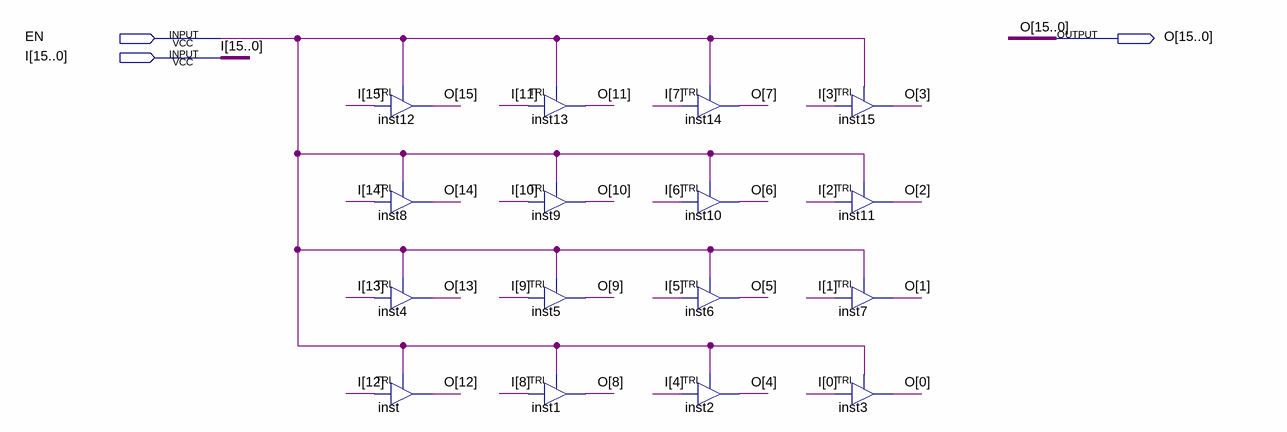
[diagram p0: schematic sheet]
// Quartus schematic tri16bit.bdf as structural Verilog: 16 symbols, 3 pins
module tri16bit (
  input  EN,
  input  [15:0] I,
  output [15:0] O
);

  TRI inst12 (.IN(I[15]), .OE(EN), .OUT(O[15]));
  TRI inst8 (.IN(I[14]), .OE(EN), .OUT(O[14]));
  TRI inst4 (.IN(I[13]), .OE(EN), .OUT(O[13]));
  TRI inst (.IN(I[12]), .OE(EN), .OUT(O[12]));
  TRI inst13 (.IN(I[11]), .OE(EN), .OUT(O[11]));
  TRI inst9 (.IN(I[10]), .OE(EN), .OUT(O[10]));
  TRI inst5 (.IN(I[9]), .OE(EN), .OUT(O[9]));
  TRI inst1 (.IN(I[8]), .OE(EN), .OUT(O[8]));
  TRI inst14 (.IN(I[7]), .OE(EN), .OUT(O[7]));
  TRI inst10 (.IN(I[6]), .OE(EN), .OUT(O[6]));
  TRI inst6 (.IN(I[5]), .OE(EN), .OUT(O[5]));
  TRI inst2 (.IN(I[4]), .OE(EN), .OUT(O[4]));
  TRI inst15 (.IN(I[3]), .OE(EN), .OUT(O[3]));
  TRI inst11 (.IN(I[2]), .OE(EN), .OUT(O[2]));
  TRI inst7 (.IN(I[1]), .OE(EN), .OUT(O[1]));
  TRI inst3 (.IN(I[0]), .OE(EN), .OUT(O[0]));
endmodule
